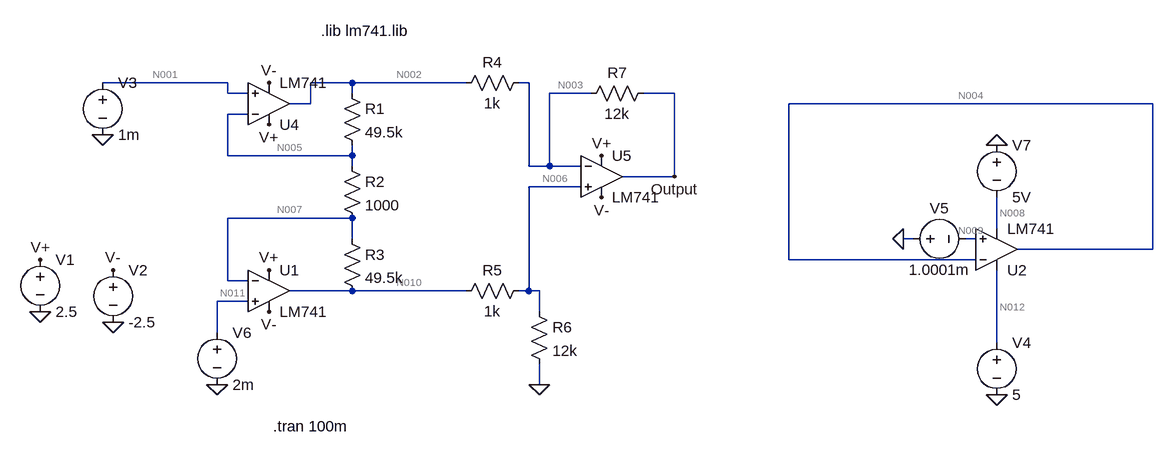
[diagram p0: schematic Amp.asc]
Amp.asc, the LTspice schematic file:
Version 4
SHEET 1 1524 680
WIRE -80 32 -272 32
WIRE 112 32 48 32
WIRE 288 32 112 32
WIRE 384 32 368 32
WIRE -80 48 -80 32
WIRE -48 48 -80 48
WIRE 112 48 112 32
WIRE 480 48 416 48
WIRE 608 48 560 48
WIRE 48 64 48 32
WIRE 48 64 16 64
WIRE 1344 64 784 64
WIRE -48 80 -80 80
WIRE -80 144 -80 80
WIRE 112 144 112 128
WIRE 112 144 -80 144
WIRE 112 160 112 144
WIRE 384 160 384 32
WIRE 416 160 416 48
WIRE 416 160 384 160
WIRE 464 160 416 160
WIRE 608 176 608 48
WIRE 608 176 528 176
WIRE 464 192 384 192
WIRE 112 240 -80 240
WIRE 1104 256 1104 208
WIRE 112 272 112 240
WIRE 976 272 960 272
WIRE 1072 272 1056 272
WIRE 1344 288 1344 64
WIRE 1344 288 1136 288
WIRE 784 304 784 64
WIRE 1072 304 784 304
WIRE -80 336 -80 240
WIRE -48 336 -80 336
WIRE 112 352 16 352
WIRE 288 352 112 352
WIRE 384 352 384 192
WIRE 384 352 368 352
WIRE 400 352 384 352
WIRE -48 368 -96 368
WIRE 400 384 400 352
WIRE -96 416 -96 368
WIRE 1104 432 1104 320
WIRE 400 496 400 464
FLAG -368 384 0
FLAG -256 400 0
FLAG -368 304 V+
FLAG -256 320 V-
FLAG 400 496 0
FLAG 608 176 Output
FLAG -16 96 V+
FLAG -16 32 V-
FLAG -16 320 V+
FLAG 496 144 V+
FLAG -16 384 V-
FLAG 496 208 V-
FLAG 1104 512 0
FLAG 960 272 0
FLAG -96 496 0
FLAG -272 112 0
FLAG 1104 128 0
SYMBOL res 96 32 R0
SYMATTR InstName R1
SYMATTR Value 49.5k
SYMBOL res 96 144 R0
SYMATTR InstName R2
SYMATTR Value 1000
SYMBOL res 96 256 R0
SYMATTR InstName R3
SYMATTR Value 49.5k
SYMBOL res 384 16 R90
WINDOW 0 0 56 VBottom 2
WINDOW 3 32 56 VTop 2
SYMATTR InstName R4
SYMATTR Value 1k
SYMBOL res 384 336 R90
WINDOW 0 0 56 VBottom 2
WINDOW 3 32 56 VTop 2
SYMATTR InstName R5
SYMATTR Value 1k
SYMBOL voltage -368 288 R0
WINDOW 123 0 0 Left 0
WINDOW 39 0 0 Left 0
SYMATTR InstName V1
SYMATTR Value 2.5
SYMBOL voltage -256 304 R0
WINDOW 123 0 0 Left 0
WINDOW 39 0 0 Left 0
SYMATTR InstName V2
SYMATTR Value -2.5
SYMBOL res 384 368 R0
SYMATTR InstName R6
SYMATTR Value 12k
SYMBOL res 576 32 R90
WINDOW 0 0 56 VBottom 2
WINDOW 3 32 56 VTop 2
SYMATTR InstName R7
SYMATTR Value 12k
SYMBOL OpAmps\\opamp2 -16 128 M180
SYMATTR InstName U4
SYMATTR Value LM741
SYMBOL OpAmps\\opamp2 -16 288 R0
SYMATTR InstName U1
SYMATTR Value LM741
SYMBOL OpAmps\\opamp2 496 112 R0
SYMATTR InstName U5
SYMATTR Value LM741
SYMBOL OpAmps\\opamp2 1104 352 M180
SYMATTR InstName U2
SYMATTR Value LM741
SYMBOL voltage 1104 416 R0
WINDOW 123 0 0 Left 0
WINDOW 39 0 0 Left 0
SYMATTR InstName V4
SYMATTR Value 5
SYMBOL voltage 960 272 M90
WINDOW 0 -32 56 VBottom 2
WINDOW 3 32 56 VTop 2
WINDOW 123 0 0 Left 0
WINDOW 39 0 0 Left 0
SYMATTR InstName V5
SYMATTR Value 1.0001m
SYMBOL voltage -272 16 R0
WINDOW 123 0 0 Left 0
WINDOW 39 0 0 Left 0
SYMATTR InstName V3
SYMATTR Value 1m
SYMBOL voltage -96 400 R0
WINDOW 123 0 0 Left 0
WINDOW 39 0 0 Left 0
SYMATTR InstName V6
SYMATTR Value 2m
SYMBOL voltage 1104 112 R0
WINDOW 123 0 0 Left 0
WINDOW 39 0 0 Left 0
SYMATTR InstName V7
SYMATTR Value 5V
TEXT 64 -48 Left 2 !.lib lm741.lib
TEXT -10 560 Left 2 !.tran 100m

The netlist it stands for:
* Amp.asc
R1 N002 N005 49.5k
R2 N005 N007 1000
R3 N007 N010 49.5k
R4 N003 N002 1k
R5 N006 N010 1k
V1 V+ 0 2.5
V2 V- 0 -2.5
R6 N006 0 12k
R7 Output N003 12k
XU4 N001 N005 V+ V- N002 LM741  ; pins In+ In- V+ V- OUT
XU1 N011 N007 V+ V- N010 LM741  ; pins In+ In- V+ V- OUT
XU5 N006 N003 V+ V- Output LM741  ; pins In+ In- V+ V- OUT
XU2 N009 N004 N012 N008 N004 LM741  ; pins In+ In- V+ V- OUT
V4 N012 0 5
V5 0 N009 1.0001m
V3 N001 0 1m
V6 N011 0 2m
V7 0 N008 5V
.lib lm741.lib
.tran 100m
.backanno
.end

* Results of the author's LTspice run, read from the files saved beside the schematic
* Operating Point, zero values left out:
*   V(n002) = -42.43 mV
*   V(n005) = 2 mV
*   V(n007) = 3 mV
*   V(n010) = 57.51 mV
*   V(n003) = 54.03 mV
*   V(n006) = 53.04 mV
*   V(v+) = 2.5 V
*   V(v-) = -2.5 V
*   V(output) = 1.213 V
*   V(n001) = 1 mV
*   V(n011) = 2 mV
*   V(n004) = -115.9 nV
*   V(n009) = -1 mV
*   V(n008) = -5 V
*   V(n012) = 5 V
*   I(R1) = -897.6 nA
*   I(R2) = -999.4 nA
*   I(R3) = -1.101 µA
*   I(R4) = 96.46 µA
*   I(R5) = -4.478 µA
*   I(R6) = 4.42 µA
*   I(R7) = 96.56 µA
*   I(V1) = -4.195 mA
*   I(V2) = 4.19 mA
*   I(V4) = -1.451 mA
*   I(V5) = 57.87 nA
*   I(V3) = -57.87 nA
*   I(V6) = -57.87 nA
*   I(V7) = -1.451 mA
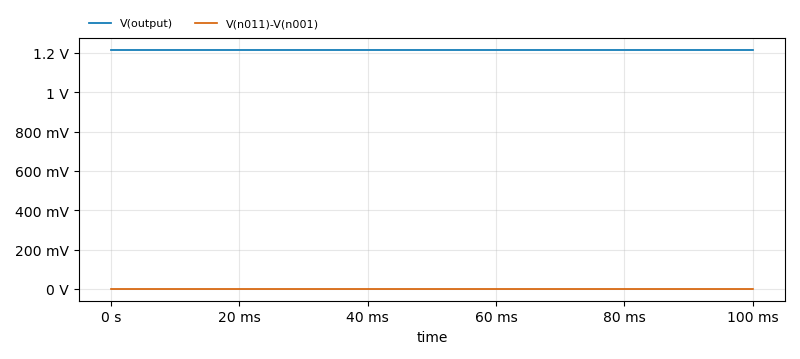
[diagram p1: Transient Analysis of Amp.asc, plotted from the saved traces]
* Transient Analysis, 1 run:
*   V(output): min 1.213 V, max 1.213 V, average 1.213 V, rms 1.213 V, last 1.213 V
*   V(n011)-V(n001): min 1 mV, max 1 mV, average 1 mV, rms 1 mV, last 1 mV